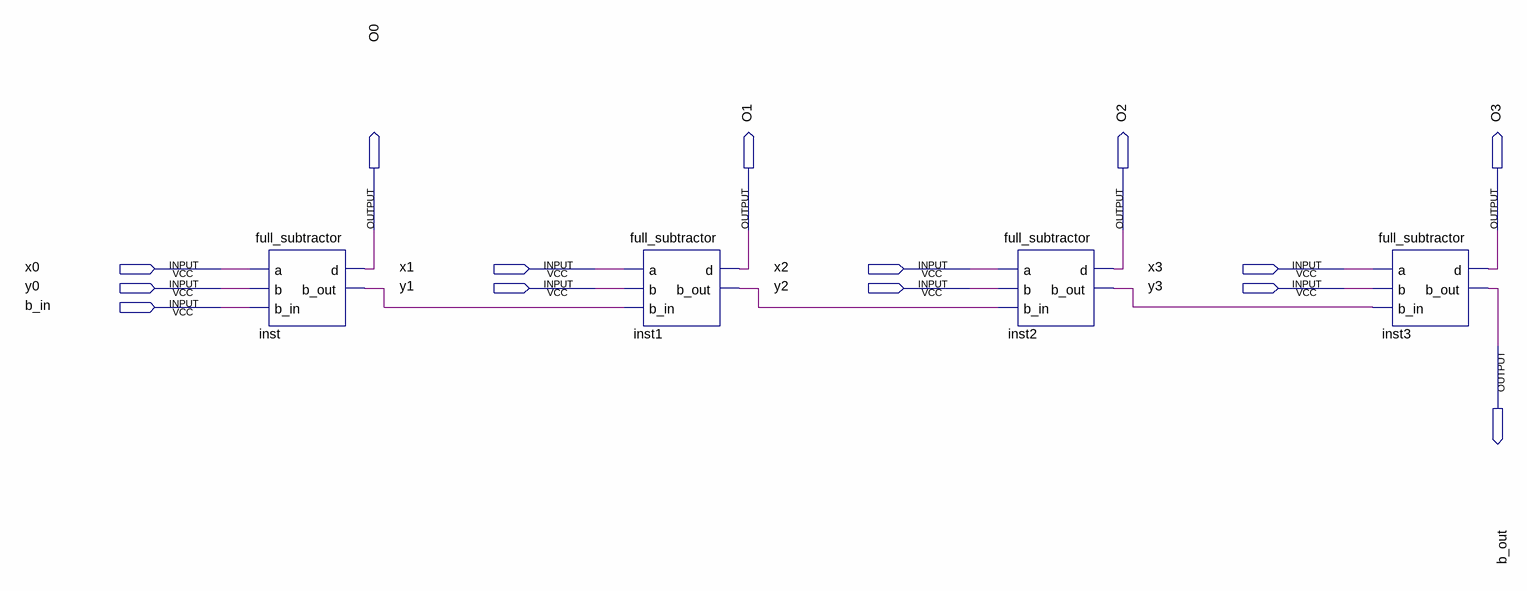
[diagram p0: schematic sheet]
// Quartus schematic SUBTRACTOR4.bdf as structural Verilog: 4 symbols, 14 pins
module SUBTRACTOR4 (
  input  x0,
  input  x1,
  input  x2,
  input  x3,
  input  y0,
  input  y1,
  input  y2,
  input  y3,
  input  b_in,
  output O0,
  output O1,
  output O2,
  output O3,
  output b_out
);

  wire inst1_b_out, inst2_b_out, inst_b_out;

  full_subtractor inst (.a(x0), .b(y0), .b_in(b_in), .d(O0), .b_out(inst_b_out));
  full_subtractor inst1 (.a(x1), .b(y1), .b_in(inst_b_out), .d(O1), .b_out(inst1_b_out));
  full_subtractor inst2 (.a(x2), .b(y2), .b_in(inst1_b_out), .d(O2), .b_out(inst2_b_out));
  full_subtractor inst3 (.a(x3), .b(y3), .b_in(inst2_b_out), .d(O3), .b_out(b_out));
endmodule
